# Altium schematic sheet Sheet1.SchDoc
size A4; SheetNumber: 1; SheetTotal: 1
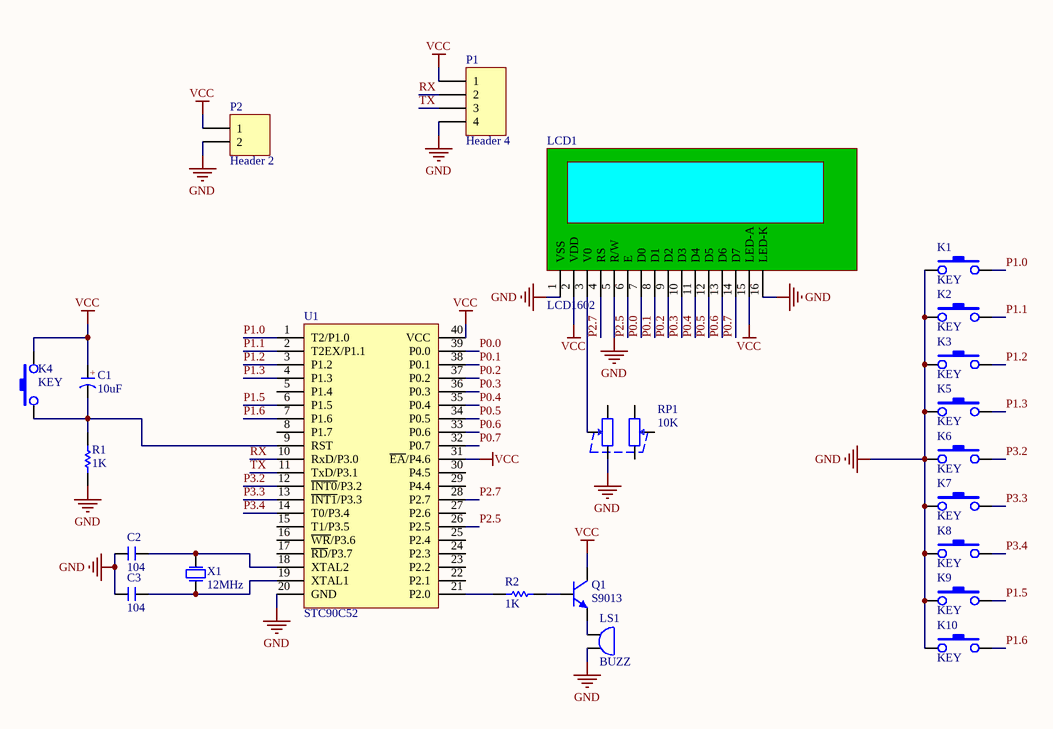
[diagram p0: Sheet1.SchDoc]

## Parts
C1  10uF  [CAP 2.5*5*11]
C2  104  [CC 1.8*3.6]
C3  104  [CC 1.8*3.6]
K1  KEY  [TSW DIP-6*6*5]
K2  KEY  [TSW DIP-6*6*5]
K3  KEY  [TSW DIP-6*6*5]
K4  KEY  [TSW DIP-6*6*5]
K5  KEY  [TSW DIP-6*6*5]
K6  KEY  [TSW DIP-6*6*5]
K7  KEY  [TSW DIP-6*6*5]
K8  KEY  [TSW DIP-6*6*5]
K9  KEY  [TSW DIP-6*6*5]
K10  KEY  [TSW DIP-6*6*5]
LCD1  LCD1602  [LCD-1602]
LS1  BUZZ  [BEEP 5x9x5.5]
P1  Header 4  [HDR1X4]
P2  Header 2  [HDR1X2]
Q1  S9013  [TO92A]
R1  1K  [RS 1/4W]
R2  1K  [RS 1/4W]
RP1  10K  [WH148-2-G15]
U1  STC90C52  [DIP40-600]
X1  12MHz  [OSC HC-49S]

## Nets
GND: C2.1 C3.1 K1.1 K2.1 K3.1 K5.1 K6.1 K7.1 K8.1 K9.1 K10.1 LCD1.1(VSS) LCD1.5(R/W) LCD1.16(LED-K) LS1.2 P1.4 P2.2 R1.1 RP1.3 U1.20(GND)
VCC: C1.1(A) K4.2 LCD1.2(VDD) LCD1.15(LED-A) P1.1 P2.1 Q1.3(C) U1.31(~{EA}/P4.6) U1.40(VCC)
P0.0: LCD1.7(D0) U1.39(P0.0)
P0.1: LCD1.8(D1) U1.38(P0.1)
P0.2: LCD1.9(D2) U1.37(P0.2)
P0.3: LCD1.10(D3) U1.36(P0.3)
P0.4: LCD1.11(D4) U1.35(P0.4)
P0.5: LCD1.12(D5) U1.34(P0.5)
P0.6: LCD1.13(D6) U1.33(P0.6)
P0.7: LCD1.14(D7) U1.32(P0.7)
P1.0: K1.2 U1.1(T2/P1.0)
P1.1: K2.2 U1.2(T2EX/P1.1)
P1.2: K3.2 U1.3(P1.2)
P1.3: K5.2 U1.4(P1.3)
P1.5: K9.2 U1.6(P1.5)
P1.6: K10.2 U1.7(P1.6)
P2.5: LCD1.6(E) U1.26(P2.5)
P2.7: LCD1.4(RS) U1.28(P2.7)
P3.2: K6.2 U1.12(~{INT0}/P3.2)
P3.3: K7.2 U1.13(~{INT1}/P3.3)
P3.4: K8.2 U1.14(T0/P3.4)
RX: P1.2 U1.10(RxD/P3.0)
TX: P1.3 U1.11(TxD/P3.1)
NetC1_2: C1.2(K) K4.1 R1.2 U1.9(RST)
NetC2_2: C2.2 U1.18(XTAL2) X1.2
NetC3_2: C3.2 U1.19(XTAL1) X1.1
NetLCD1_3: LCD1.3(V0) RP1.2
NetLS1_1: LS1.1 Q1.1(E)
NetQ1_2: Q1.2(B) R2.1
NetR2_2: R2.2 U1.21(P2.0)

Not connected (* = marked no-connect by the designer): RP1 1 4 5 6; U1 5(P1.4) 8(P1.7) 15(T1/P3.5) 16(~{WR}/P3.6) 17(~{RD}/P3.7) 22(P2.1) 23(P2.2) 24(P2.3) 25(P2.4) 27(P2.6) 29(P4.4) 30(P4.5)

## Notes on the sheet
- (in symbol CE) +

## Library data of the parts
C1 = CE: 直插电解电容; 淘宝ID: 小糖豆的小窝窝; BOM名称: 直插电解电容; 下单链接: https://item.taobao.com/item.htm?ft=t&id=613637044352
C2 C3 = CC: 瓷片电容; 淘宝ID: 小糖豆的小窝窝; BOM名称: 瓷片电容; 下单链接: https://item.taobao.com/item.htm?ft=t&id=613637044352
K1-K10 = KEY: 四角直插开关; 淘宝ID: 小糖豆的小窝窝; BOM名称: 四角直插开关; 下单链接: https://item.taobao.com/item.htm?ft=t&id=613637044352
LCD1 = LCD1602: 淘宝ID: 小糖豆的小窝窝; BOM名称: LCD 1602; 下单链接: https://item.taobao.com/item.htm?ft=t&id=613637044352
LS1 = BUZZ: 蜂鸣器; 淘宝ID: 小糖豆的小窝窝; BOM名称: 蜂鸣器; 下单链接: https://item.taobao.com/item.htm?ft=t&id=613637044352
P1 = Header 4: Header, 4-Pin; LatestRevisionDate: 17-Jul-2002; LatestRevisionNote: Re-released for DXP Platform.; Publisher: Altium Limited
P2 = Header 2: Header, 2-Pin; LatestRevisionDate: 17-Jul-2002; LatestRevisionNote: Re-released for DXP Platform.; Publisher: Altium Limited
Q1 = 9013-DIP: 低频放大-NPN型; 淘宝ID: 小糖豆的小窝窝; BOM名称: 低频放大-NPN型; 下单链接: https://item.taobao.com/item.htm?ft=t&id=613637044352
R1 R2 = Res: 色环电阻; 淘宝ID: 小糖豆的小窝窝; BOM名称: 色环电阻; 下单链接: https://item.taobao.com/item.htm?ft=t&id=613637044352
RP1 = RP-WH148: 双联电位器; 淘宝ID: 小糖豆的小窝窝; BOM名称: 双联电位器; 下单链接: https://item.taobao.com/item.htm?ft=t&id=613637044352
U1 = STC90C52: STC单片机; 淘宝ID: 小糖豆的小窝窝; BOM名称: STC单片机; Alias1: https://item.taobao.com/item.htm?ft=t&id=613637044352
X1 = XTAL-2P: 2脚无源脚晶振; 淘宝ID: 小糖豆的小窝窝; BOM名称: 2脚无源脚晶振; 下单链接: https://item.taobao.com/item.htm?ft=t&id=613637044352